# Altium schematic sheet FailSafe.SchDoc: FailSafe
size A3; SheetNumber: 3; SheetTotal: 7
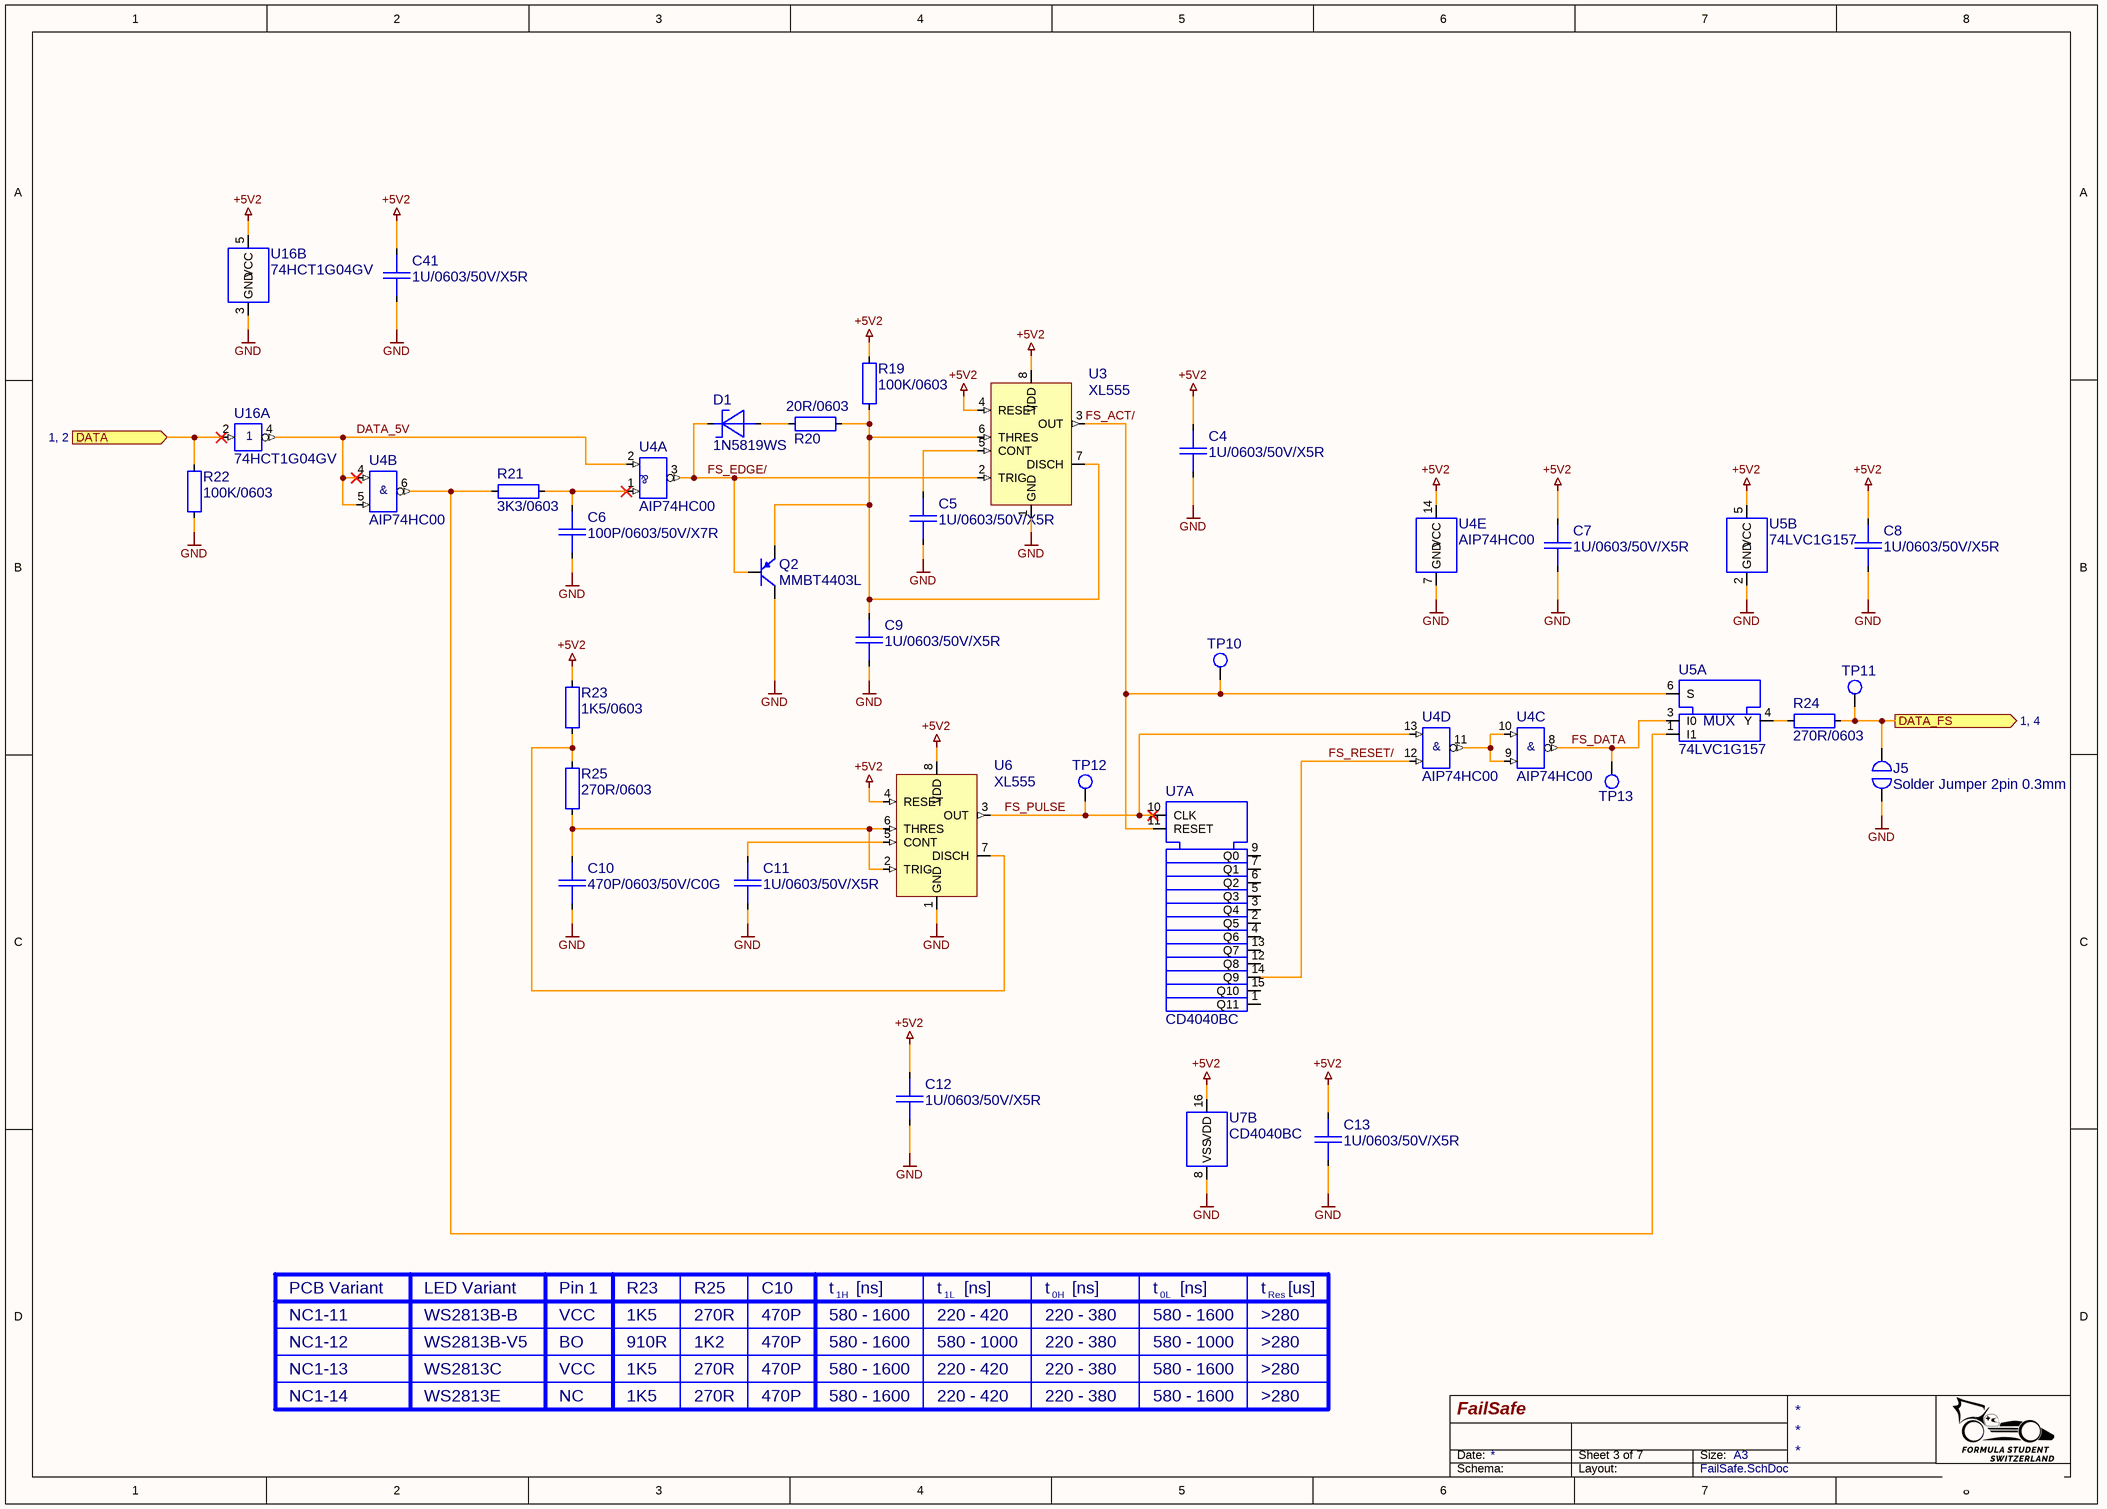
[diagram p0: FailSafe.SchDoc]

## Parts
C4  1U/0603/50V/X5R  [CAP0603_X7R]
C5  1U/0603/50V/X5R  [CAP0603_X7R]
C6  100P/0603/50V/X7R  [CAP0603_X7R]
C7  1U/0603/50V/X5R  [CAP0603_X7R]
C8  1U/0603/50V/X5R  [CAP0603_X7R]
C9  1U/0603/50V/X5R  [CAP0603_X7R]
C10  470P/0603/50V/C0G  [CAP0603_C0G]
C11  1U/0603/50V/X5R  [CAP0603_X7R]
C12  1U/0603/50V/X5R  [CAP0603_X7R]
C13  1U/0603/50V/X5R  [CAP0603_X7R]
C41  1U/0603/50V/X5R  [CAP0603_X7R]
D1  1N5819WS  [SOD2513X100]
J5  Solder Jumper 2pin 0.3mm  [Solder_Jumper_2pin_0.3mm]
Q2  MMBT4403L  [SOT2395P280X125-3-SE]
R19  100K/0603  [R0603-0.40-WW]
R20  20R/0603  [R0603-0.40-WW]
R21  3K3/0603  [R0603-0.40-WW]
R22  100K/0603  [R0603-0.40-WW]
R23  1K5/0603  [R0603-0.40-WW]
R24  270R/0603  [R0603-0.40-WW]
R25  270R/0603  [R0603-0.40-WW]
TP10  TP_THD_1.5/0.8  [TP_THD_1.5/0.8]  (value not drawn)  (no BOM)
TP11  TP_THD_1.5/0.8  [TP_THD_1.5/0.8]  (value not drawn)  (no BOM)
TP12  TP_THD_1.5/0.8  [TP_THD_1.5/0.8]  (value not drawn)  (no BOM)
TP13  TP_THD_1.5/0.8  [TP_THD_1.5/0.8]  (value not drawn)  (no BOM)
U3  XL555  [SOP127P600X155-8-SW]
U4  AIP74HC00  [SOP127P600X155-14-SW]  (parts A,B,C,D,E of 5)
U5  74LVC1G157  [SOT65P210X95-6-SE]  (parts A,B of 2)
U6  XL555  [SOP127P600X155-8-SW]
U7  CD4040BC  [SOP127P600X155-16-SW]  (parts A,B of 2)
U16  74HCT1G04GV  [SOT2395P280X125-5-NW]  (parts A,B of 2)

## Ports
DATA (in, see 1, 2), DATA_FS (out, see 1, 4)

## Nets
+5V2: C4.1 C7.1 C8.1 C12.1 C13.1 C41.1 R19.1 R23.1 U3.4(RESET) U3.8(VDD) U4.14(VCC) U5.5(VCC) U6.4(RESET) U6.8(VDD) U7.16(VDD) U16.5(VCC)
GND: C4.2 C5.2 C6.2 C7.2 C8.2 C9.2 C10.2 C11.2 C12.2 C13.2 C41.2 J5.2 Q2.3(COLLECTOR) R22.1 U3.1(GND) U4.7(GND) U5.2(GND) U6.1(GND) U7.8(VSS) U16.3(GND)
DATA: R22.2 U16.2(A) ; port DATA
DATA_5V: U4.2(B0) U4.4(A1) U4.5(B1) U16.4(Y)
DATA_FS: J5.1 R24.2 TP11.1 ; port DATA_FS
FS_ACT/: TP10.1 U3.3(OUT) U5.6(S) U7.11(RESET)
FS_DATA: TP13.1 U4.8(Y2) U5.3(I0)
FS_EDGE/: D1.1 Q2.1(BASE) U3.2(TRIG) U4.3(Y0)
FS_PULSE: TP12.1 U4.13(A3) U6.3(OUT) U7.10(CLK)
FS_RESET/: U4.12(B3) U7.14(Q9)
NetC5_1: C5.1 U3.5(CONT)
NetC6_1: C6.1 R21.2 U4.1(A0)
NetC9_1: C9.1 Q2.2(EMITTER) R19.2 R20.2 U3.6(THRES) U3.7(DISCH)
NetC10_1: C10.1 R25.2 U6.2(TRIG) U6.6(THRES)
NetC11_1: C11.1 U6.5(CONT)
NetD1_2: D1.2 R20.1
NetR21_1: R21.1 U4.6(Y1) U5.1(I1)
NetR23_2: R23.2 R25.1 U6.7(DISCH)
NetR24_1: R24.1 U5.4(Y)
NetU4_9: U4.9(B2) U4.10(A2) U4.11(Y3)

Not connected (* = marked no-connect by the designer): U7 1(Q11) 2(Q5) 3(Q4) 4(Q6) 5(Q3) 6(Q2) 7(Q1) 9(Q0) 12(Q8) 13(Q7) 15(Q10)

## Notes on the sheet
- PCB Variant
- NC1-11
- LED Variant
- WS2813B-B
- Pin 1
- VCC
- R23
- 1K5
- R25
- 270R
- C10
- 470P
- t
- 580 - 1600
- 1H
- [ns]
- 220 - 420
- 1L
- 220 - 380
- 0H
- 0L
- >280
- Res
- [us]
- NC1-12
- NC1-13
- NC1-14
- WS2813B-V5
- WS2813C
- WS2813E
- BO
- NC
- 910R
- 1K2
- 580 - 1000
- Date:
- Size:
- A3
- Schema:
- Layout:
- (in symbol 74HCT1G04GV, part A) 1
- (in symbol 74LVC1G157, part A) MUX
- (in symbol AIP74HC00, part A) &
- (in symbol AIP74HC00, part B) &
- (in symbol AIP74HC00, part C) &
- (in symbol AIP74HC00, part D) &

## Library data of the parts
C4 C5 C7-C9 C11-C13 C41 = 1U/0603/50V/X5R: CAP SM 0603 1.0uF 50V X5R; Manufacturer: GENERIC; Absolute Value: 1E-6; Part Number: 1U/0603/50V/X5R; Package: 603; Value: 1.0uF; Manufacturer Part Number 3: CL10A105KB8NNNC; Supplier 3: LCSC; Supplier Part Number 3: C15849; JLC Type: Basic
C6 = 100P/0603/50V/X7R: CAP SM 0603 100pF 50V X7R; Manufacturer: GENERIC; Manufacturer 1: YAGEO; Manufacturer Part Number 1: CC0603KPX7R9BB101; Absolute Value: 1E-10; Eurocircuits GPN: GPC0603101; Part Number: 100P/0603/50V/X7R; Package: 0603; Value: 100pF; HelpURL: https://www.yageo.com/upload/media/product/app/datasheet/mlcc/upy-gphc_x7r_6_3v-to-250v.pdf; Supplier 1: Digi-Key; Supplier Part Number 1: 13-CC0603KPX7R9BB101CT-ND; Manufacturer 2: YAGEO; Manufacturer Part Number 2: CC0603KRX7R9BB101; Supplier 2: Digi-Key; Supplier Part Number 2: 311-3601-1-ND
C10 = 470P/0603/50V/C0G: CAP SM 0603 470pF 50V C0G; Manufacturer: GENERIC; Manufacturer 1: YAGEO; Manufacturer Part Number 1: CC0603JRNPO9BN471; Absolute Value: 4.7E-10; Part Number: 470P/0603/50V/C0G; Package: 603; Value: 470pF; HelpURL: https://www.yageo.com/upload/media/product/productsearch/datasheet/mlcc/UPY-GP_NP0_16V-to-50V_18.pdf; Supplier 1: Digi-Key; Supplier Part Number 1: 311-1520-1-ND; Manufacturer 2: YAGEO; Manufacturer Part Number 2: CC0603KRNPO9BN471; Supplier 2: Digi-Key; Supplier Part Number 2: 311-4038-1-ND; Manufacturer Part Number 3: GCM1885C1H471JA16D; Supplier 3: LCSC; Supplier Part Number 3: C126566; JLC Type: Extended
D1 = 1N5819WS: 40V 600mV@1A 1A SOD-323 Schottky Barrier Diodes (SBD) ROHS; Manufacturer: GENERIC; Part Number: 1N5819WS; Package: SOD323; Value: 1N5819WS; Absolute Value: 40V; HelpURL: https://datasheet.lcsc.com/lcsc/2204281430_Guangdong-Hottech-1N5819WS_C191023.pdf; Manufacturer 3: Guangdong Hottech; Manufacturer Part Number 3: 1N5819WS; Supplier 3: LCSC; Supplier Part Number 3: C191023; JLC Type: Basic
J5 = Solder_Jumper_2pin_0.3mm: Solder jumper with two pins with a spacing of 0.3mm; Manufacturer: NONE; Part Number: Solder_Jumper_2pin_0.3mm
Q2 = MMBT4403L: Switching Transistor PNP Silicon; Manufacturer: ON SEMI; Part Number: MMBT4403L; Package: SOT23; HelpURL: https://www.onsemi.com/pdf/datasheet/mmbt4403lt1-d.pdf; Manufacturer 3: ONSEMI; Manufacturer Part Number 3: MMBT4403LT1G; Supplier 3: LCSC; Supplier Part Number 3: C78864; JLC Type: Extended
R19 R22 = 100K/0603: RES SM 0603 100K; Manufacturer: GENERIC; Manufacturer 1: YAGEO; Manufacturer Part Number 1: RC0603FR-13100KL; Absolute Value: 100000; Part Number: 100K/0603; Package: 0603; Value: 100K; HelpURL: https://www.yageo.com/upload/media/product/productsearch/datasheet/rchip/PYu-RC_Group_51_RoHS_L_12.pdf; Supplier 1: Digi-Key; Supplier Part Number 1: 13-RC0603FR-13100KLCT-ND; Manufacturer 2: YAGEO; Manufacturer Part Number 2: RC0603FR-10100KL; Supplier 2: Digi-Key; Supplier Part Number 2: 13-RC0603FR-10100KLCT-ND; Manufacturer 3: UNI-ROYAL(Uniroyal Elec); Manufacturer Part Number 3: 0603WAF1003T5E; Supplier 3: LCSC; Supplier Part Number 3: C25803; JLC Type: Basic
R20 = 20R/0603: RES SM 0603 20R; Manufacturer: GENERIC; Manufacturer 1: YAGEO; Manufacturer Part Number 1: RC0603FR-1320RL; Absolute Value: 20; Part Number: 20R/0603; Package: 0603; Value: 20R; HelpURL: https://www.yageo.com/upload/media/product/app/datasheet/rchip/pyu-rc_group_51_rohs_l.pdf; Supplier 1: Digi-Key; Supplier Part Number 1: 13-RC0603FR-1320RLCT-ND; Manufacturer 2: YAGEO; Manufacturer Part Number 2: RC0603FR-1020RL; Supplier 2: Digi-Key; Supplier Part Number 2: 13-RC0603FR-1020RLCT-ND; Manufacturer 3: UNI-ROYAL(Uniroyal Elec); Manufacturer Part Number 3: 0603WAF200JT5E; Supplier 3: LCSC; Supplier Part Number 3: C22950; JLC Type: Basic
R21 = 3K3/0603: RES SM 0603 3K3; Manufacturer: GENERIC; Manufacturer 1: YAGEO; Manufacturer Part Number 1: RC0603FR-133K3L; Absolute Value: 3300; Eurocircuits GPN: GPR06033K3; Part Number: 3K3/0603; Package: 0603; Value: 3K3; HelpURL: https://www.yageo.com/upload/media/product/app/datasheet/rchip/pyu-rc_group_51_rohs_l.pdf; Supplier 1: Digi-Key; Supplier Part Number 1: 13-RC0603FR-133K3LCT-ND; Manufacturer 2: YAGEO; Manufacturer Part Number 2: RC0603FR-103K3L; Supplier 2: Digi-Key; Supplier Part Number 2: 13-RC0603FR-103K3LCT-ND
R23 = 1K5/0603: RES SM 0603 1K5; Manufacturer: GENERIC; Manufacturer 1: YAGEO; Manufacturer Part Number 1: RC0603FR-131K5L; Absolute Value: 1500; Part Number: 1K5/0603; Package: 0603; Value: 1K5; HelpURL: https://www.yageo.com/upload/media/product/app/datasheet/rchip/pyu-rc_group_51_rohs_l.pdf; Supplier 1: Digi-Key; Supplier Part Number 1: 13-RC0603FR-131K5LCT-ND; Manufacturer 2: YAGEO; Manufacturer Part Number 2: RC0603FR-101K5L; Supplier 2: Digi-Key; Supplier Part Number 2: 13-RC0603FR-101K5LCT-ND; Manufacturer 3: UNI-ROYAL(Uniroyal Elec); Manufacturer Part Number 3: 0603WAF1501T5E; Supplier 3: LCSC; Supplier Part Number 3: C22843; JLC Type: Basic
R24 R25 = 270R/0603: RES SM 0603 270R; Manufacturer: GENERIC; Manufacturer 1: YAGEO; Manufacturer Part Number 1: RC0603FR-13270RL; Absolute Value: 270; Part Number: 270R/0603; Package: 0603; Value: 270R; HelpURL: https://www.yageo.com/upload/media/product/productsearch/datasheet/rchip/PYu-RC_Group_51_RoHS_L_12.pdf; Supplier 1: Digi-Key; Supplier Part Number 1: 13-RC0603FR-13270RLCT-ND; Manufacturer 2: YAGEO; Manufacturer Part Number 2: RC0603FR-10270RL; Supplier 2: Digi-Key; Supplier Part Number 2: 13-RC0603FR-10270RLCT-ND; Manufacturer 3: UNI-ROYAL(Uniroyal Elec); Manufacturer Part Number 3: 0603WAF2700T5E; Supplier 3: LCSC; Supplier Part Number 3: C22966; JLC Type: Basic
TP10-TP13 = TP_THD_1.5/0.8: THT Test Point 1.5/0.8mm; Manufacturer: NONE; Part Number: TP_THD_1.5/0.8
U3 U6 = XL555: SOP-8 Timers / Clock Oscillators ROHS; Manufacturer: XINLUDA; Part Number: XL555; Package: SOP8; HelpURL: https://datasheet.lcsc.com/lcsc/2212101330_XINLUDA-XL555_C521186.pdf; Manufacturer 3: XINLUDA; Manufacturer Part Number 3: XL555; Supplier 3: LCSC; Supplier Part Number 3: C521186; JLC Type: Extended
U4 = AIP74HC00: Quad 2-input NAND; Manufacturer: Wuxi I-core Elec; Part Number: AIP74HC00; Package: SOP-14; Manufacturer 3: Wuxi I-core Elec; Manufacturer Part Number 3: AIP74HC00SA.TB; Supplier 3: LCSC; Supplier Part Number 3: C2943283; JLC Type: Extended
U5 = 74LVC1G157: Single 2-input multiplexer; Manufacturer: Nexperia; Part Number: 74LVC1G157; Package: SOT-363-6; Manufacturer 3: Nexperia; Manufacturer Part Number 3: 74LVC1G157GW,125; Supplier 3: LCSC; Supplier Part Number 3: C135822; JLC Type: Extended
U7 = CD4040BC: 12-Stage binary ripple Counter; Manufacturer: HGSEMI; Part Number: CD4040BC; Package: SOP-16; Manufacturer 3: HGSEMI; Manufacturer Part Number 3: CD4040BM/TR; Supplier 3: LCSC; Supplier Part Number 3: C725347; JLC Type: Extended
U16 = 74HCT1G04GV: Single inverter, SOT23-5; Manufacturer: Nexperia; Manufacturer 1: Nexperia USA Inc.; Manufacturer Part Number 1: 74HCT1G04GV,125; Part Number: 74HCT1G04GV; Package: SOT23-5; HelpURL: https://assets.nexperia.com/documents/data-sheet/74HC_HCT1G04.pdf; Supplier 1: Digi-Key; Supplier Part Number 1: 1727-6925-1-ND; Manufacturer 3: Nexperia; Manufacturer Part Number 3: 74HCT1G04GV,125; Supplier 3: LCSC; Supplier Part Number 3: C12503; JLC Type: Extended